# Altium schematic sheet BT .SchDoc
size A3
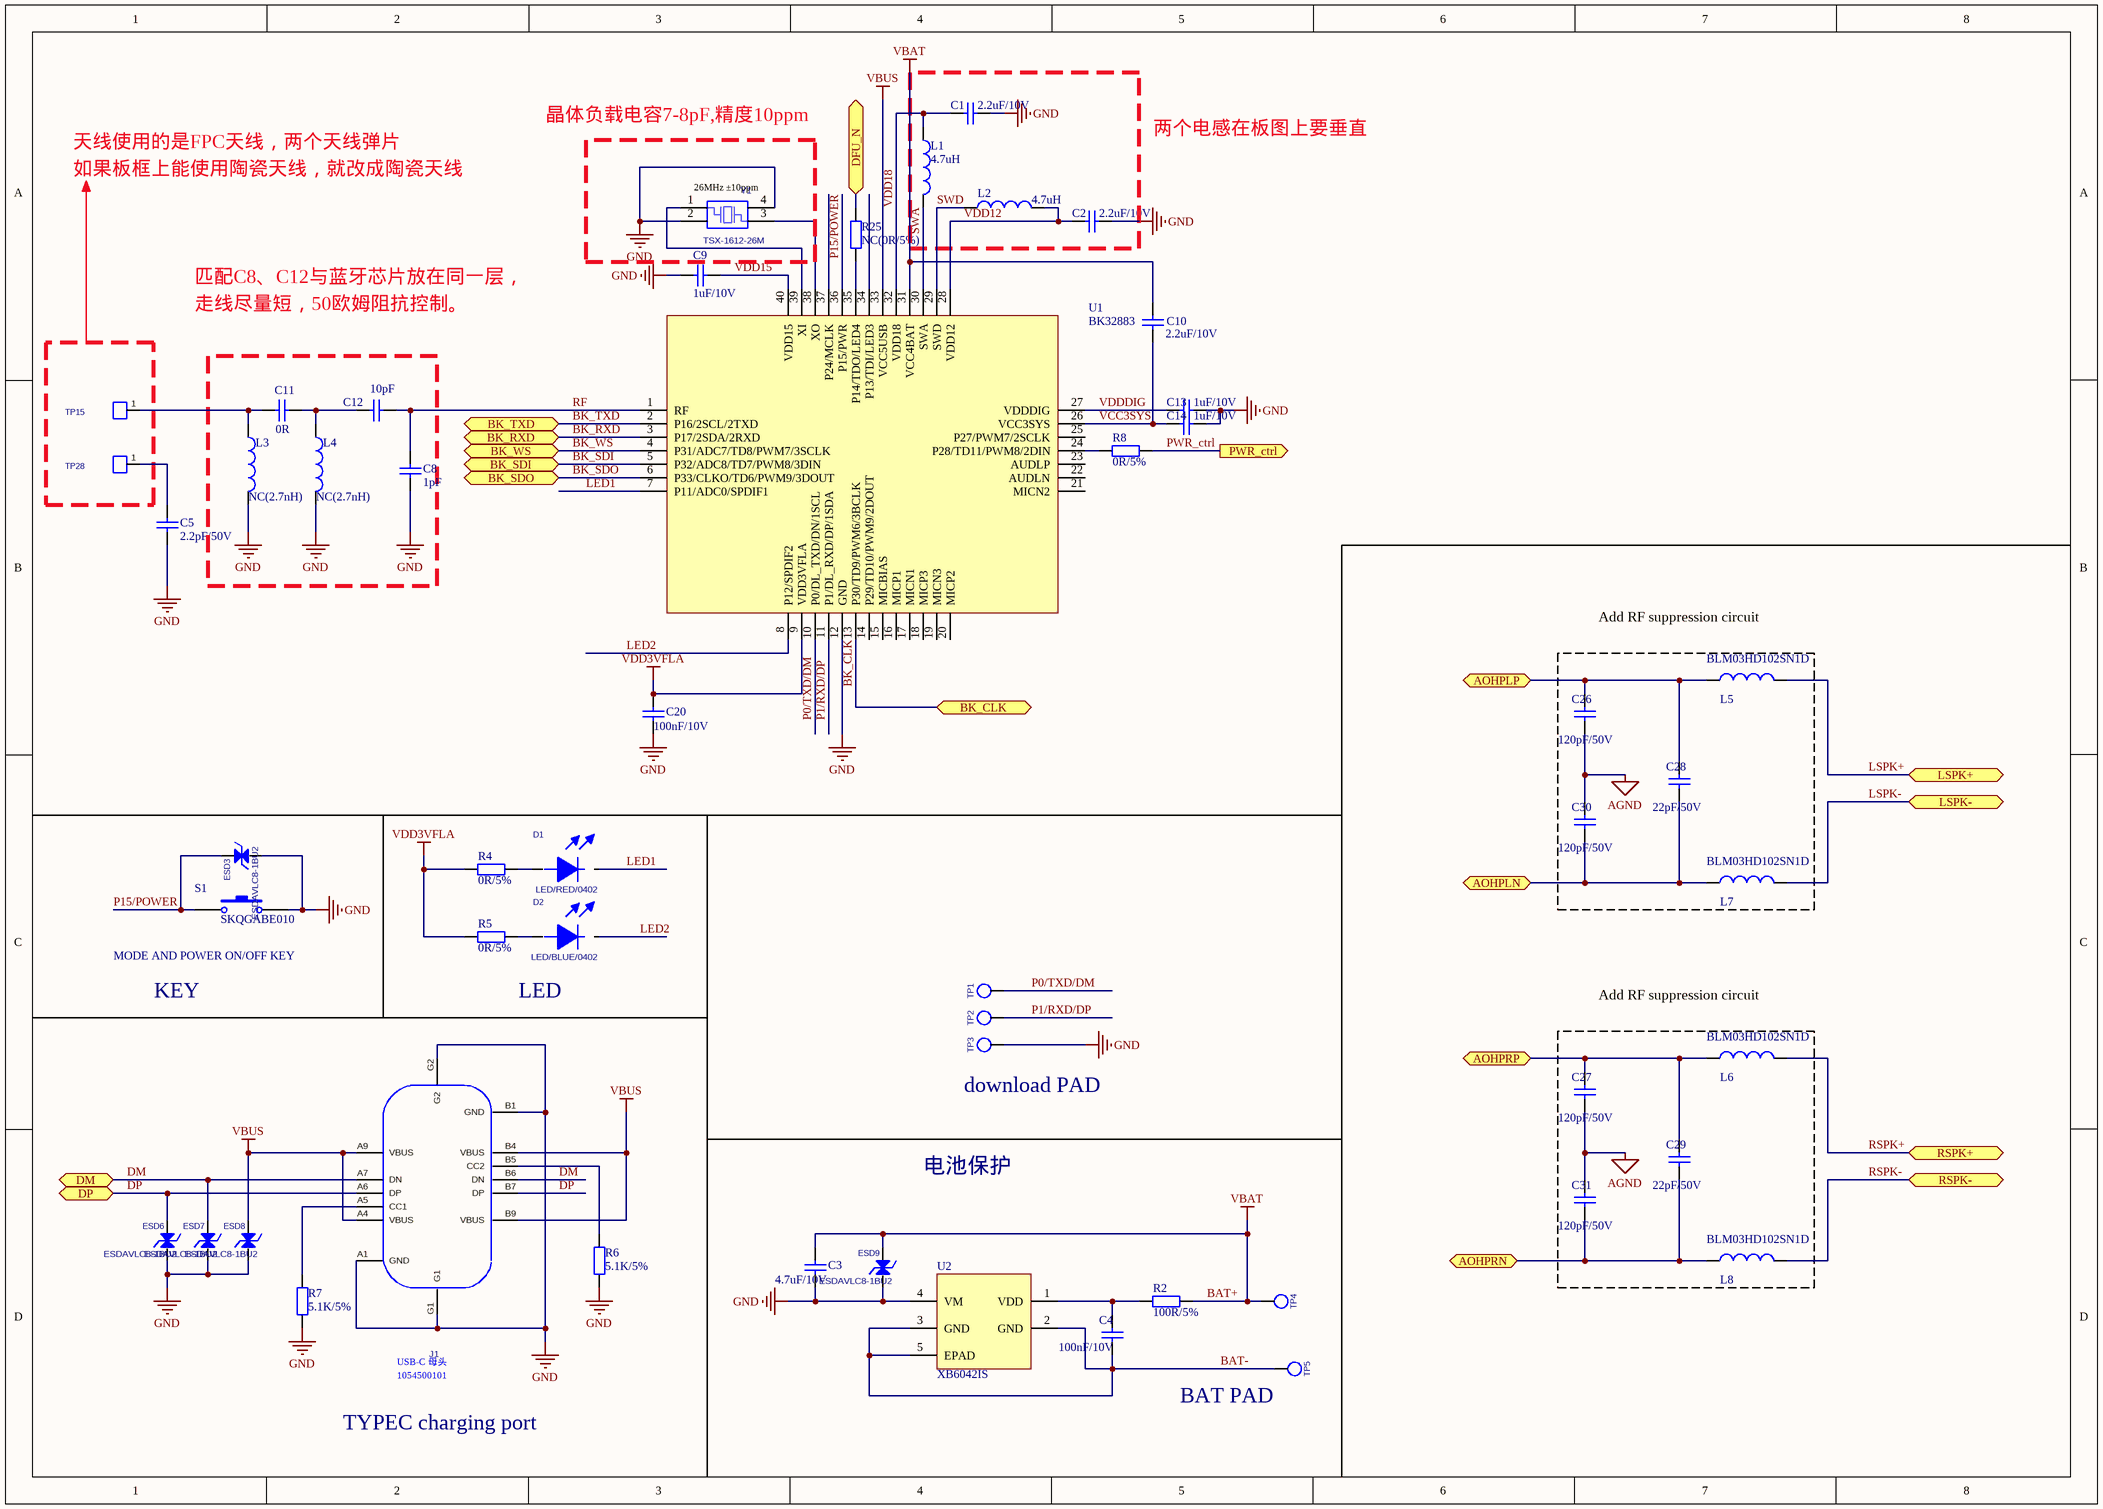
[diagram p0: BT .SchDoc]

## Parts
C1  2.2uF/10V  [C0402]
C2  2.2uF/10V  [C0402]
C3  4.7uF/10V  [C0402]
C4  100nF/10V  [0201]
C5  2.2pF/50V  [0201]
C8  1pF  [0201]
C9  1uF/10V  [0201]
C10  2.2uF/10V  [C0402]
C11  0R  [0201]
C12  10pF  [0201]
C13  1uF/10V  [0201]
C14  1uF/10V  [0201]
C20  100nF/10V  [0201]
C26  120pF/50V  [0201]
C27  120pF/50V  [0201]
C28  22pF/50V  [0201]
C29  22pF/50V  [0201]
C30  120pF/50V  [0201]
C31  120pF/50V  [0201]
D1  LED/RED/0402  [LED0402]
D2  LED/BLUE/0402  [LED0402]
ESD3  ESDAVLC8-1BU2  [0201]
ESD6  ESDAVLC8-1BU2  [0201]
ESD7  ESDAVLC8-1BU2  [0201]
ESD8  ESDAVLC8-1BU2  [0201]
ESD9  ESDAVLC8-1BU2  [0201]
J1  TYPEC  [USB-TYPEC - 12]  (value not drawn)
L1  4.7uH  [R0603]
L2  4.7uH  [R0603]
L3  NC(2.7nH)  [0201]
L4  NC(2.7nH)  [0201]
L5  BLM03HD102SN1D  [0201]
L6  BLM03HD102SN1D  [0201]
L7  BLM03HD102SN1D  [0201]
L8  BLM03HD102SN1D  [0201]
R2  100R/5%  [0201]
R4  0R/5%  [0201]
R5  0R/5%  [0201]
R6  5.1K/5%  [0201]
R7  5.1K/5%  [0201]
R8  0R/5%  [0201]
R25  NC(0R/5%)  [0201]
S1  SKQGABE010  [TD-302060]
TP1  TP1  [TP1-1MM]  (value not drawn)
TP2  TP1  [TP1-1MM]  (value not drawn)
TP3  TP1  [TP1-1MM]  (value not drawn)
TP4  TP1  [TP1-1MM]  (value not drawn)
TP5  TP1  [TP1-1MM]  (value not drawn)
TP15  TP  [PAD]  (value not drawn)
TP28  TP  [PAD]  (value not drawn)
U1  BK32883  [QFN40_4X5]
U2  XB6042IS  [UTDFN-1X1-4]
Y1  TSX-1612-26M  [SF1612]

## Blocks framed on the sheet
26MHz ±10ppm: Y1

## Ports
AOHPLN, AOHPLP, AOHPRN, AOHPRP, BK_CLK, BK_RXD, BK_SDI, BK_SDO, BK_TXD, BK_WS, DFU_N, DM, DP, LSPK+, LSPK-, PWR_ctrl (out), RSPK+, RSPK-

## Nets
AGND: C26.1 C27.1 C30.2 C31.2
BAT+: C3.1 C10.2 ESD9.1 R2.1 TP4.1 U1.31(VCC4BAT)  [also labelled VBAT]
GND: C1.2 C2.2 C3.2 C5.2 C8.2 C9.1 C13.2 C14.2 C20.2 ESD3.2 ESD6.2 ESD7.2 ESD8.2 ESD9.2 J1.A1(GND) J1.B1(GND) J1.G1 J1.G2 L3.2 L4.2 R6.2 R7.2 S1.1 TP3.1 U1.12(GND) U2.4(VM) Y1.2 Y1.4
VBUS: ESD8.1 J1.A4(VBUS) J1.A9(VBUS) J1.B4(VBUS) J1.B9(VBUS) U1.33(VCC5USB)
VDD3VFLA: C20.1 R4.2 R5.2 U1.9(VDD3VFLA)
AOHPLN: C28.1 C30.1 L7.1 ; port AOHPLN
AOHPLP: C26.2 C28.2 L5.1 ; port AOHPLP
AOHPRN: C29.1 C31.1 L8.1 ; port AOHPRN
AOHPRP: C27.2 C29.2 L6.1 ; port AOHPRP
BAT-: C4.1 TP5.1 U2.2(GND) U2.3(GND) U2.5(EPAD)
BK_CLK: U1.13(P30/TD9/PWM6/3BCLK) ; port BK_CLK
BK_RXD: U1.3(P17/2SDA/2RXD) ; port BK_RXD
BK_SDI: U1.5(P32/ADC8/TD7/PWM8/3DIN) ; port BK_SDI
BK_SDO: U1.6(P33/CLKO/TD6/PWM9/3DOUT) ; port BK_SDO
BK_TXD: U1.2(P16/2SCL/2TXD) ; port BK_TXD
BK_WS: U1.4(P31/ADC7/TD8/PWM7/3SCLK) ; port BK_WS
DFU_N: R25.1 ; port DFU_N
DM: ESD7.1 J1.A7(DN) J1.B6(DN) ; port DM
DP: ESD6.1 J1.A6(DP) J1.B7(DP) ; port DP
LED1: D1.1 U1.7(P11/ADC0/SPDIF1)
LED2: D2.1 U1.8(P12/SPDIF2)
LSPK+: L5.2 ; port LSPK+
LSPK-: L7.2 ; port LSPK-
P0/TXD/DM: TP1.1 U1.10(P0/DL_TXD/DN/1SCL)
P1/RXD/DP: TP2.1 U1.11(P1/DL_RXD/DP/1SDA)
P15/POWER: ESD3.1 S1.2 U1.36(P15/PWR)
PWR_ctrl: R8.1 ; port PWR_ctrl
RF: C8.1 C12.1 U1.1(RF)
RSPK+: L6.2 ; port RSPK+
RSPK-: L8.2 ; port RSPK-
SWA: L1.2 U1.30(SWA)
SWD: L2.1 U1.29(SWD)
VCC3SYS: C10.1 C14.1 U1.26(VCC3SYS)
VDD12: C2.1 L2.2 U1.28(VDD12)
VDD15: C9.2 U1.40(VDD15)
VDD18: C1.1 L1.1 U1.32(VDD18)
VDDDIG: C13.1 U1.27(VDDDIG)
NetC4_2: C4.2 R2.2 U2.1(VDD)
NetC5_1: C5.1 TP28.1
NetC11_1: C11.1 C12.2 L4.1
NetC11_2: C11.2 L3.1 TP15.1
NetD1_2: D1.2 R4.1
NetD2_2: D2.2 R5.1
NetJ1_A5: J1.A5(CC1) R7.1
NetJ1_B5: J1.B5(CC2) R6.1
NetR8_2: R8.2 U1.24(P28/TD11/PWM8/2DIN)
NetR25_2: R25.2 U1.35(P14/TDO/LED4)
NetU1_38: U1.38(XO) Y1.3
NetU1_39: U1.39(XI) Y1.1

Not connected (* = marked no-connect by the designer): J1 A2(TX1+) A3(TX1-) A8(SBU1) A10(RX2-) A11(RX2+) A12(GND) B2(TX2+) B3(TX2-) B8(SBU2) B10(RX1-) B11(RX1+) B12(GND) G3 G4 G5 G6; U1 14(P29/TD10/PWM9/2DOUT) 15(MICBIAS) 16(MICP1) 17(MICN1) 18(MICP3) 19(MICN3) 20(MICP2) 21(MICN2) 22(AUDLN) 23(AUDLP) 25(P27/PWM7/2SCLK) 34(P13/TDI/LED3) 37(P24/MCLK)

## Notes on the sheet
- 天线使用的是FPC天线，两个天线弹片
- 如果板框上能使用陶瓷天线，就改成陶瓷天线
- 晶体负载电容7-8pF,精度10ppm
- 两个电感在板图上要垂直
- 匹配C8、C12与蓝牙芯片放在同一层，
- 走线尽量短，50欧姆阻抗控制。
- Add RF suppression circuit
- (near S1) MODE AND POWER ON/OFF KEY
- KEY
- LED
- (near TP3) download PAD
- 电池保护
- USB-C 母头
- 1054500101
- TYPEC charging port
- (near TP5) BAT PAD

## Library data of the parts
C1-C5 C8-C14 C20 C26-C31 = Cap Semi: Capacitor (Semiconductor SIM Model); Value: 100pF; Published: 8-Jun-2000; LatestRevisionDate: 29-May-2009; LatestRevisionNote: IPC-7351 Footprint Added.; PackageReference: C1206; Publisher: Altium Limited; PackageDescription: Chip Capacitor
D1 D2 = LED0603: PCB DECAL: LED0603
  D1: Value: LED/RED/0402
  D2: Value: LED/BLUE/0402
ESD3 ESD6-ESD9 = ESD: Sim.Analog.Order: Model$; PCB DECAL: 0402
J1 = TYPEC: PCB DECAL: DX07VN24WA2
L1-L8 = Inductor: Code_IEC: 1005; Value: 10mH; Published: 8-Jun-2000; LatestRevisionDate: 29-May-2009; LatestRevisionNote: IPC-7351 Footprint Added.; PackageReference: 0402-A; Publisher: Altium Limited; PackageDescription: Chip Inductor; Code_JEITA: 0402
R2 R4-R8 R25 = Res2: Resistor; Value: 1M; Published: 8-Jun-2000; LatestRevisionDate: 17-Jul-2002; LatestRevisionNote: Re-released for DXP Platform.; PackageReference: AXIAL-0.4; Publisher: Altium Limited; PackageDescription: Axial Device, Thru-Hole; 2 Leads; 0.4 in Pin Spacing
S1 = SW-PB: Switch; Published: 24-Mar-1999; LatestRevisionDate: 17-Jul-2002; LatestRevisionNote: Re-released for DXP Platform.; PackageReference: SPST-2; Publisher: Altium Limited; PackageDescription: Switch; 2 Leads
TP15 TP28 = TP: PCB DECAL: RCT-0805-TP
U1 = BK3288_QFN40_4X5
Y1 = SF1612: PCB DECAL: SF1612; Value: TSX-1612-26M
TP1-TP5 = TP1: PCB DECAL: TP1